# EasyEDA Pro project RoboClawHat.eprj

# Schematic Schematic1
Create Date: 2022-11-27; Page Name: Power; Project Name: Raven; Schematic Name: Schematic1; Update Date: 2022-11-27; Company: Wimble Robotics; Drawed: Michael Wimble; Page Size: A4; Part Number: JLCPCB-002; Reviewed: Michael Wimble; Version: V1.0
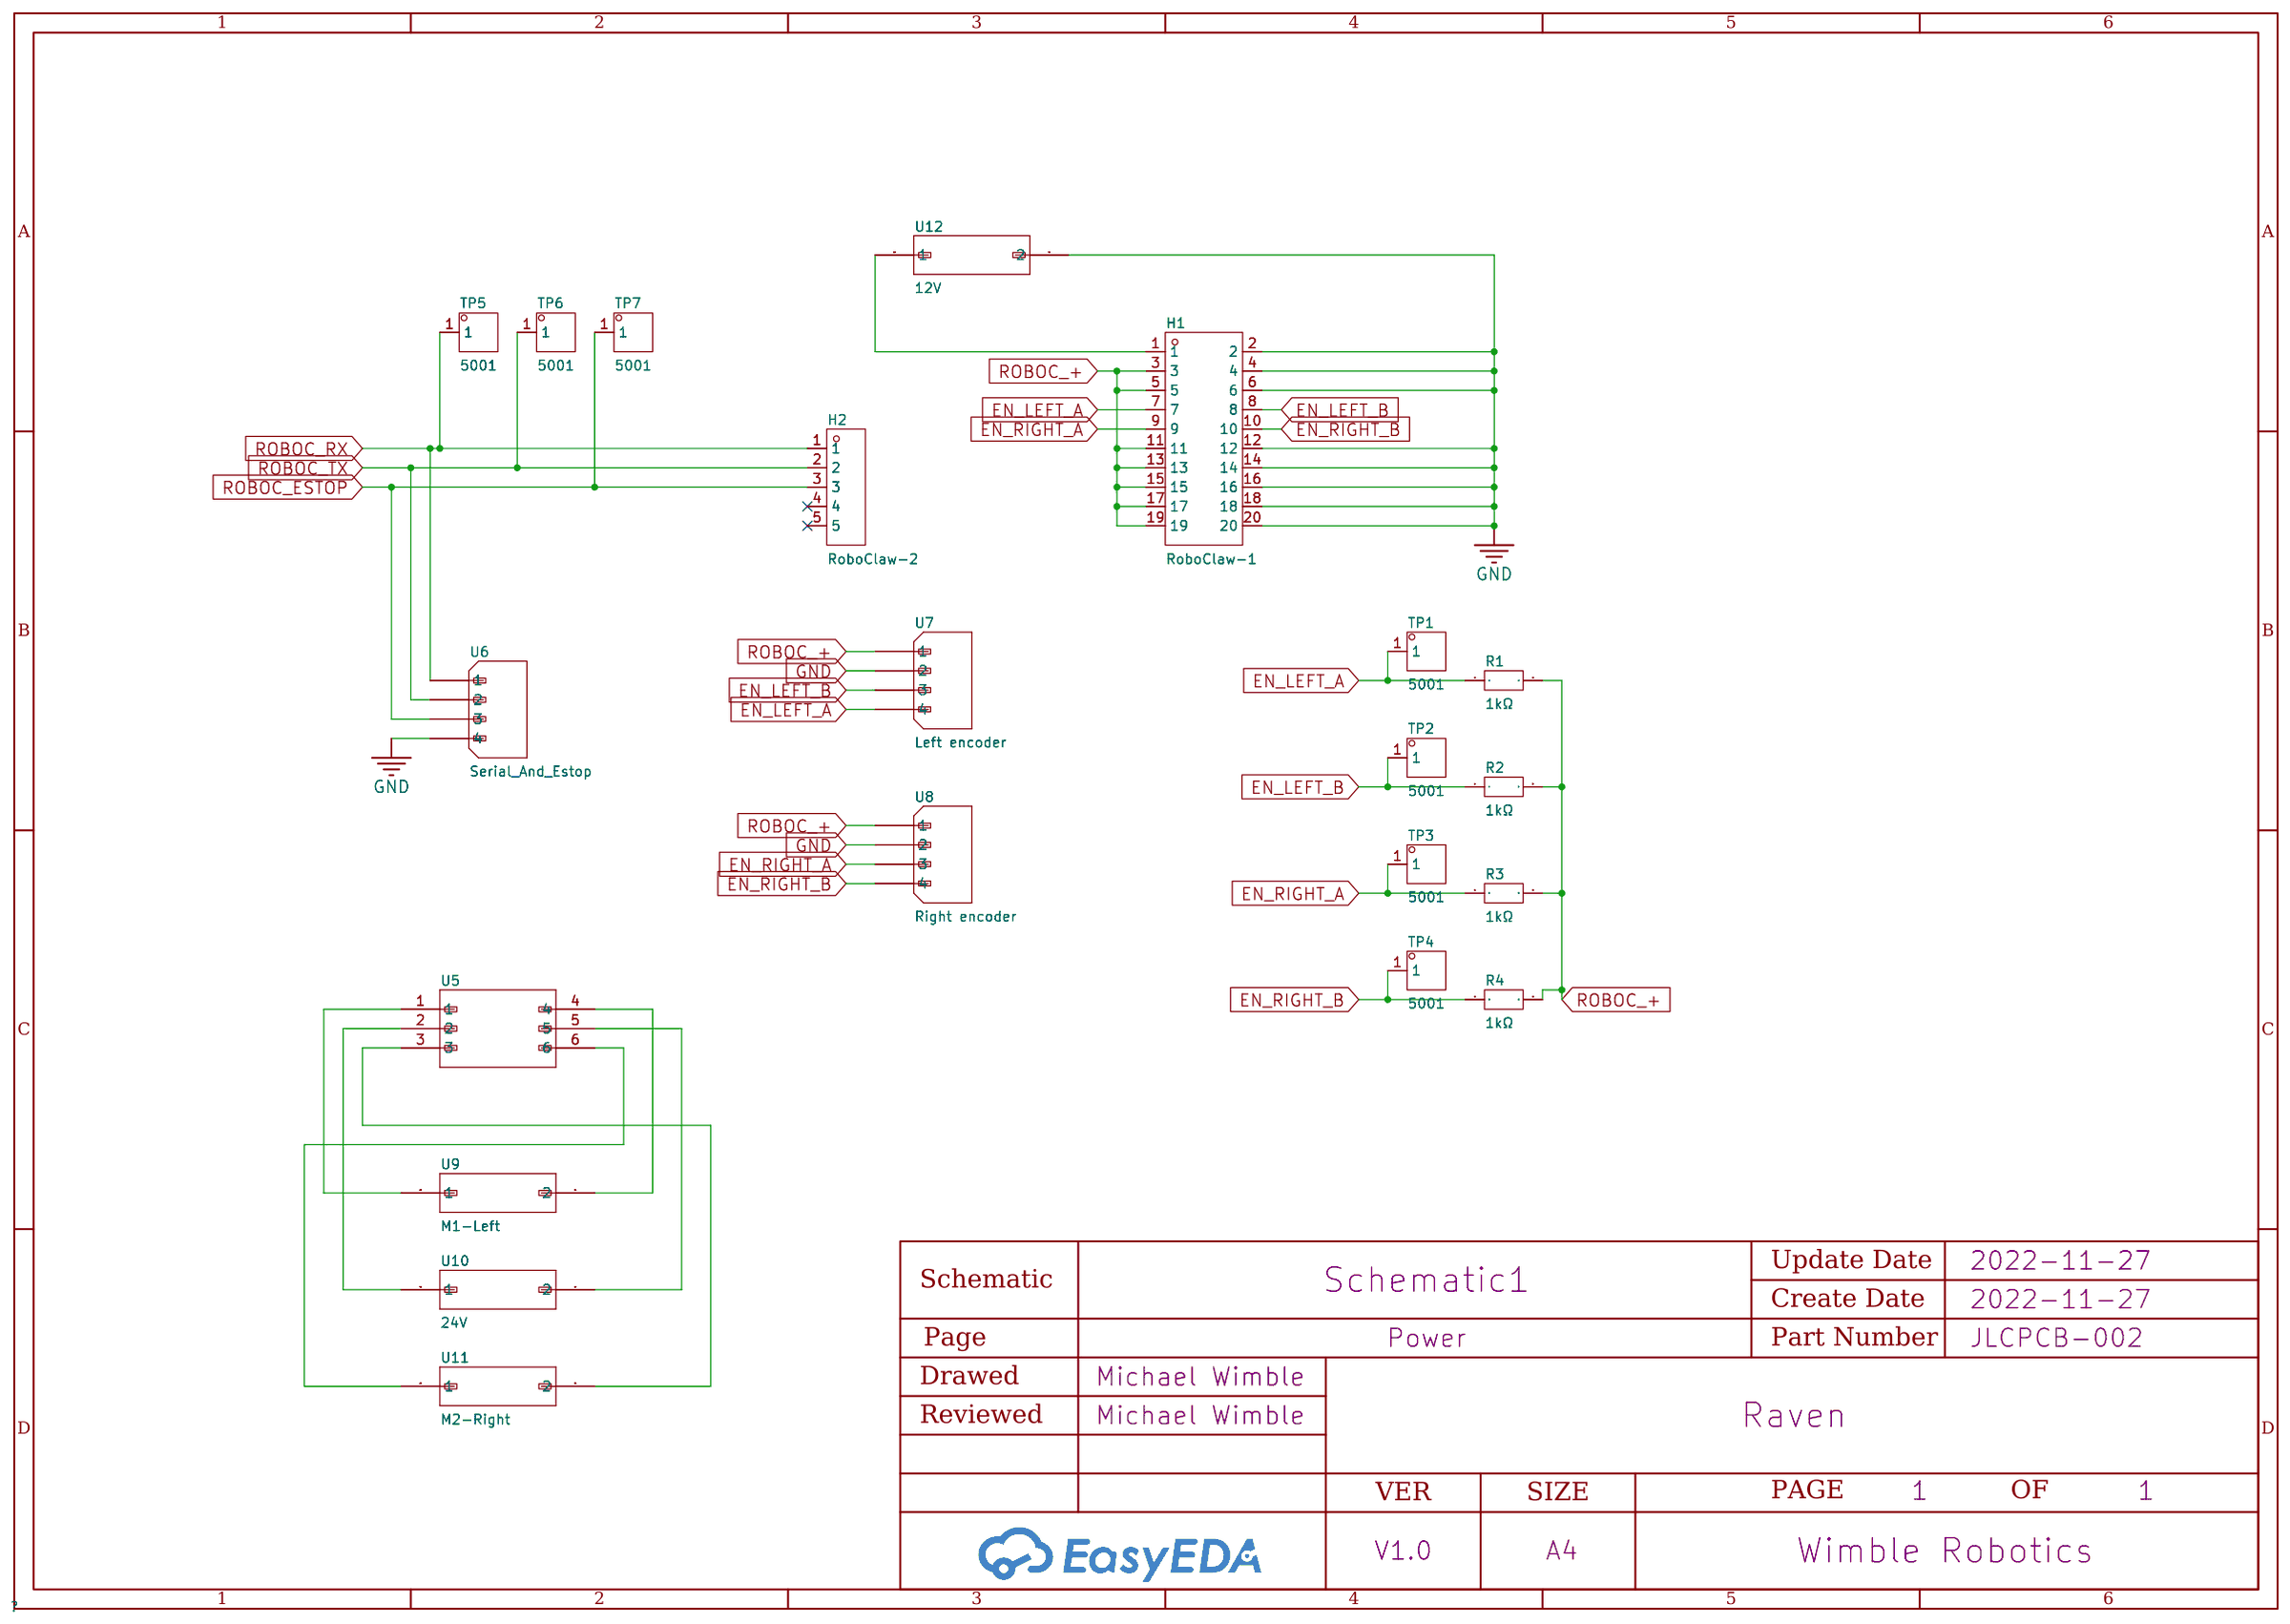
[diagram p0: schematic sheet]

## Parts
H1  RoboClaw-1  [HDR-TH_20P-P2.54-V-M-R2-C10-S2.54]
H2  RoboClaw-2  [HDR-TH_5P-P2.54-V-M]
R1  1kΩ  [R0603]
R2  1kΩ  [R0603]
R3  1kΩ  [R0603]
R4  1kΩ  [R0603]
TP1  5001  [TEST-TH_BD2.54-P1.39]
TP2  5001  [TEST-TH_BD2.54-P1.39]
TP3  5001  [TEST-TH_BD2.54-P1.39]
TP4  5001  [TEST-TH_BD2.54-P1.39]
TP5  5001  [TEST-TH_BD2.54-P1.39]
TP6  5001  [TEST-TH_BD2.54-P1.39]
TP7  5001  [TEST-TH_BD2.54-P1.39]
U5  -  [MOLEX_2068320601]
U6  Serial_And_Estop  [MOLEX_533750410]
U7  Left encoder  [MOLEX_533750410]
U8  Right encoder  [MOLEX_533750410]
U9  M1-Left  [MOLEX_2068320201]
U10  24V  [MOLEX_2068320201]
U11  M2-Right  [MOLEX_2068320201]
U12  12V  [MOLEX_2068320201]

## Library data of the parts
H1 = PZ254V-12-20P: Pitch:2.54mm Number of Pins:20 Number of Rows:2 Pin Structure:2x10P Row Spacing:2.54mm Mounting Type:直插 Circluar Pins/Square Pins:方针 Current Rating (Max):- Voltage Rating (Max):- Length of Mating Pin:6mm Insulation Height:2.5mm Length of End Connection Pi; LCSC Part Name: 2.54mm 2x10P 直插 方针; Supplier Part: C492427; Manufacturer: XFCN(兴飞); Supplier Footprint: 直插,P=2.54mm; JLCPCB Part Class: Extended Part; Datasheet: https://atta.szlcsc.com/upload/public/pdf/source/20200309/C492427_9411E93D35F2EC20CED9A3ED9F4BBE60.pdf; Supplier: LCSC; Pitch: 2.54mm; Number of Pins: 20; Number of Rows: 2; Pin Structure: 2x10P; Row Spacing: 2.54mm; Mounting Type: 直插; Circluar Pins/Square Pins: 方针; Length of Mating Pin: 6mm; Insulation Height: 2.5mm; Length of End Connection Pin: 3mm; Contact Material: 黄铜; Operating Temperature Range: -40~+105; Color: 黑色
H2 = PZ254V-11-05P: Pitch:2.54mm Number of Pins:5 Number of Rows:1 Pin Structure:1x5P Row Spacing:- Mounting Type:直插 Circluar Pins/Square Pins:方针 Current Rating (Max):- Voltage Rating (Max):- Length of Mating Pin:6mm Insulation Height:2.5mm Length of End Connection Pin:3mm C; LCSC Part Name: 2.54mm 1x5P 直插 方针; Supplier Part: C492404; Manufacturer: XFCN(兴飞); Supplier Footprint: 直插,P=2.54mm; JLCPCB Part Class: Extended Part; Datasheet: https://atta.szlcsc.com/upload/public/pdf/source/20200309/C492404_E51533260F8710EFF5D4617281164C1D.pdf; Supplier: LCSC; Pitch: 2.54mm; Number of Pins: 5; Number of Rows: 1; Pin Structure: 1x5P; Mounting Type: 直插; Circluar Pins/Square Pins: 方针; Length of Mating Pin: 6mm; Insulation Height: 2.5mm; Length of End Connection Pin: 3mm; Contact Material: 黄铜; Operating Temperature Range: -40~+105; Color: 黑色
R1-R4 = FRC0603J102 TS: Type:Thick Film Resistors Resistance: Tolerance:±5% Tolerance:±5% Power(Watts): Temperature Coefficient: Temperature Coefficient: Overload Voltage (Max): Operating Temperature Range: Operating Temperature Range:; LCSC Part Name: 1kΩ ±5% 100mW; Supplier Part: C2907113; Manufacturer: FOJAN(富捷); Supplier Footprint: 0603; JLCPCB Part Class: Extended Part; Datasheet: https://atta.szlcsc.com/upload/public/pdf/source/20211102/08480A48F159CF742D398A1E4DC90941.pdf; Supplier: LCSC; Type: Thick Film Resistors; Tolerance: ±5%
TP1-TP7 = 5001_C238122: Supplier Part: C238122; Manufacturer: Keystone; JLCPCB Part Class: Extended Part; Datasheet: https://atta.szlcsc.com/upload/public/pdf/source/20180629/C238122_5414CA0820D317C81C4E2A76836F6CFC.PDF; Supplier: LCSC
U5 = Molex 6-pin locking 12.5A/pin 2068320601
U6-U8 = Molex 4-pin locking 533750410
U9-U12 = 2068320201: Supplier Part: https://www.digikey.com/en/products/detail/molex/2068320201/10209711

## Nets
GND: H1.2 H1.3 H1.4 H1.5 H1.6 H1.7 H1.8 H1.9 H1.10 H1.11 H1.12 H1.13 H1.14 H1.15 H1.16 H1.17 H1.18 H1.19 H1.20 H2.1 H2.2 H2.3 R1.1 R1.2 R2.1 R2.2 R3.1 R3.2 R4.1 R4.2 TP1.1 TP2.1 TP3.1 TP4.1 TP5.1 TP6.1 TP7.1 U6.(4) U7.(4) U8.(4) U12.BLACK(2)
Net-(H1-1): H1.1 U12.RED(1)
Net-(U5-1): U5.1 U9.RED(1)
Net-(U5-2): U5.2 U10.RED(1)
Net-(U5-3): U5.3 U11.BLACK(2)
Net-(U5-4): U5.4 U9.BLACK(2)
Net-(U5-5): U5.5 U10.BLACK(2)
Net-(U5-6): U5.6 U11.RED(1)

Not connected (* = marked no-connect by the designer): H2 4* 5*

# Board PCB1
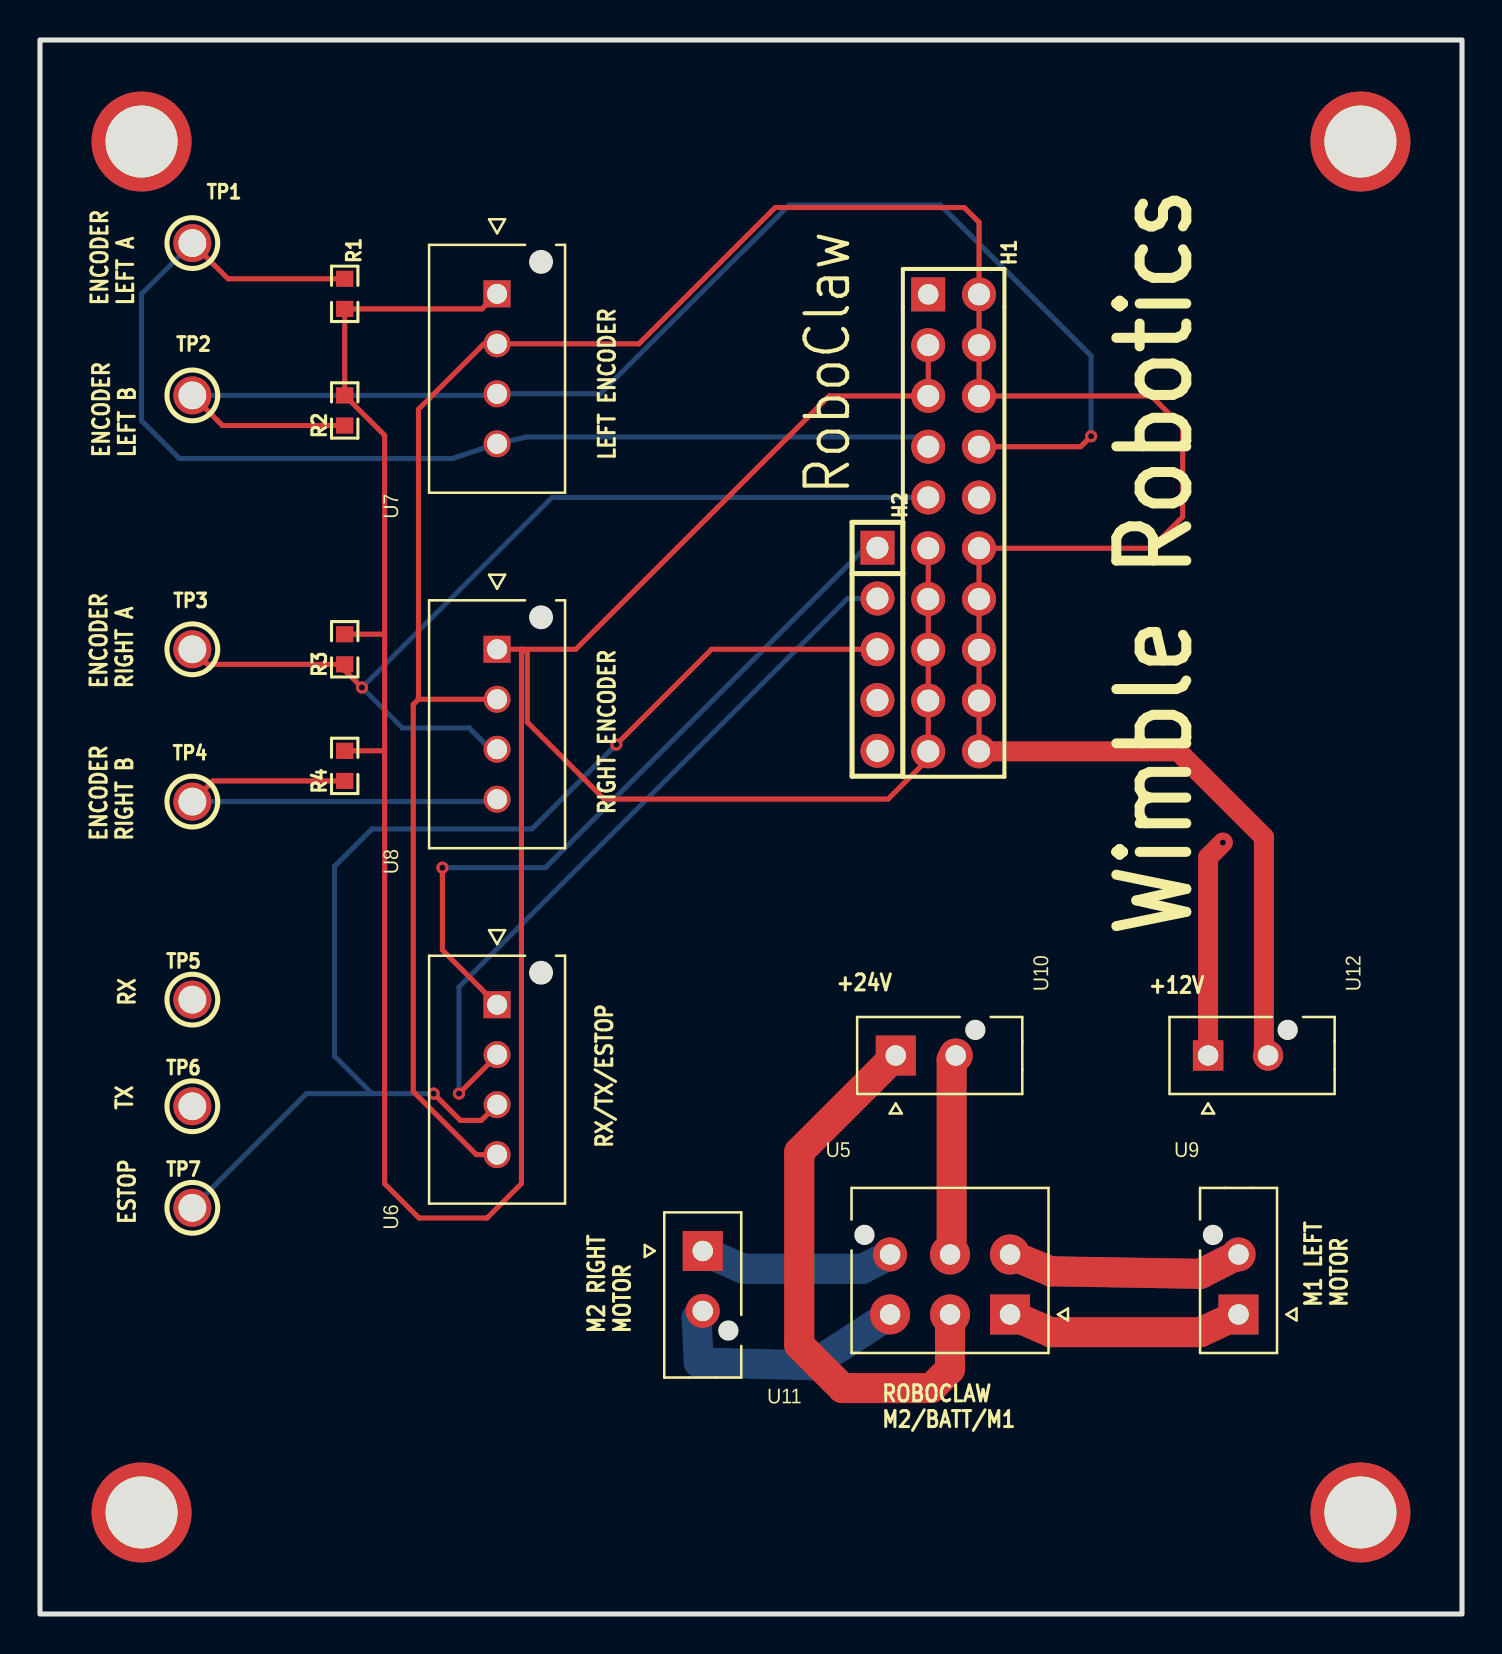
[diagram p1: board, top side]
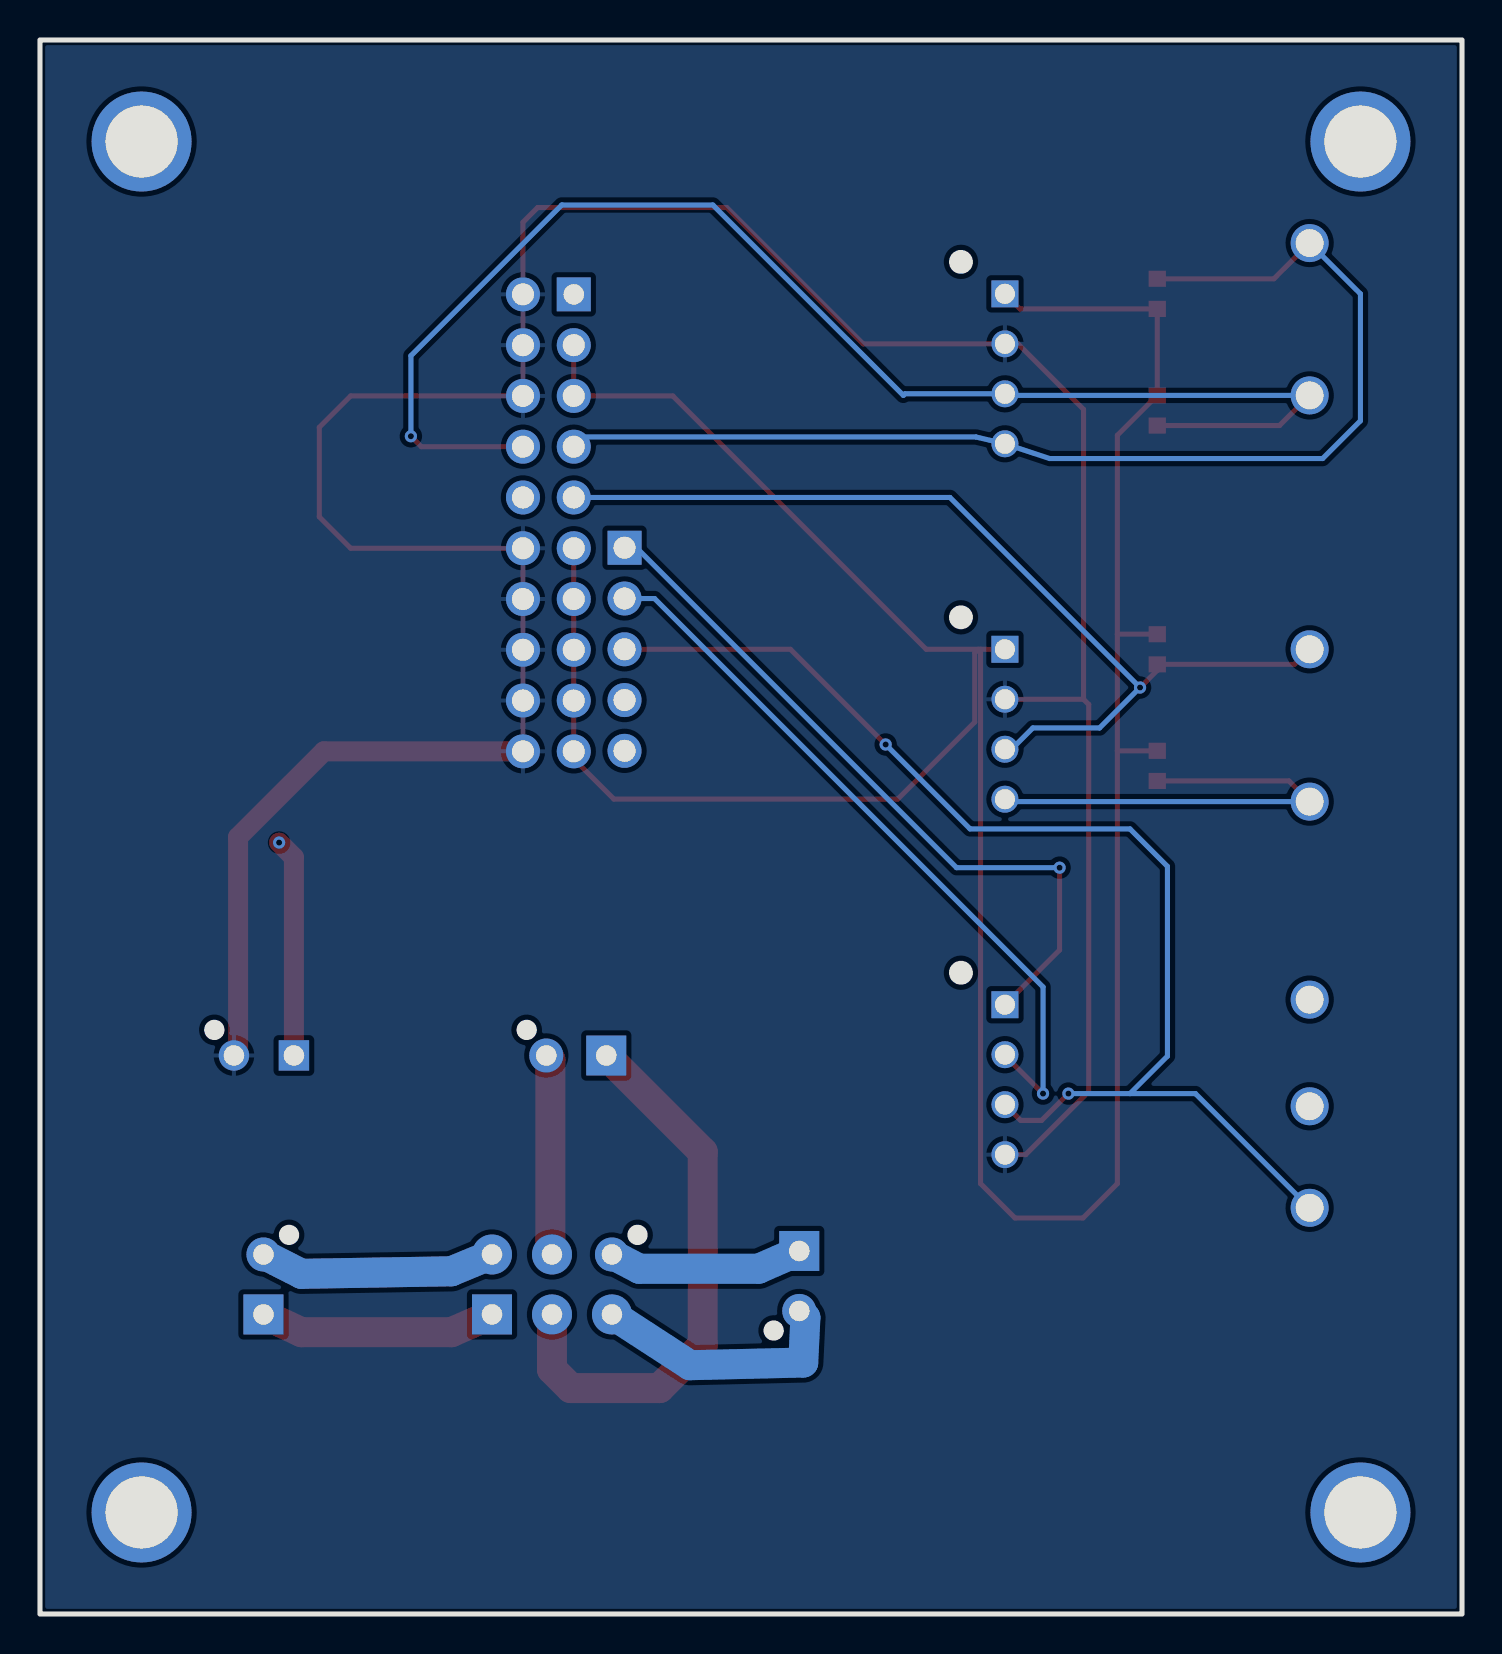
[diagram p2: board, bottom side, seen from below]

Outline 71.12 x 78.74 mm; copper layers: Top Layer, Inner1, Inner2, Bottom Layer. Coordinates in mm from the lower left corner of the outline.
Outline path: rectangle 0,78.74 71.12,0
Stack: Top Layer 0.035mm / Dielectric1 0.48mm PP er 4.5 / Inner1 0.035mm / Dielectric2 0.48mm FR4 er 4.5 / Inner2 0.035mm / Dielectric3 0.48mm PP er 4.5 / Bottom Layer 0.035mm

## Design rules (mm)
spacing safeClearance (default): track to track 0.152, other pairs 0.152 to 0.3
track width trackWidth (default): min 0.127, default 0.254, max 2.54
differential pair differentialPair (default): width min 0.127, default 0.254, max 2.54; gap min 0.152, default 0.152
via viaSize (default): diameter min 0.5, default 0.61, max 10; hole min 0.3, default 0.305, max 6

## Placement (name value [footprint] x y rotation side)
H1  RoboClaw-1  [HDR-TH_20P-P2.54-V-M-R2-C10-S2.54]  45.69 54.58 270 top
H2  RoboClaw-2  [HDR-TH_5P-P2.54-V-M]  41.89 48.26 270 top
NOREF  -  [Pad_e205]  66.04 5.08 270 top
NOREF#2  -  [Pad_e201]  66.04 73.66 270 top
NOREF#3  -  [Pad_e203]  5.08 73.66 270 top
NOREF#4  -  [Pad_e204]  5.08 5.08 270 top
R1  1kΩ  [R0603]  15.24 66.04 270 top
R2  1kΩ  [R0603]  15.24 60.21 90 top
R3  1kΩ  [R0603]  15.24 48.26 90 top
R4  1kΩ  [R0603]  15.24 42.43 90 top
TP1  5001  [TEST-TH_BD2.54-P1.39]  7.62 68.58 0 top
TP2  5001  [TEST-TH_BD2.54-P1.39]  7.62 60.96 0 top
TP3  5001  [TEST-TH_BD2.54-P1.39]  7.62 48.26 0 top
TP4  5001  [TEST-TH_BD2.54-P1.39]  7.62 40.64 0 top
TP5  5001  [TEST-TH_BD2.54-P1.39]  7.62 30.73 0 top
TP6  5001  [TEST-TH_BD2.54-P1.39]  7.62 25.4 0 top
TP7  5001  [TEST-TH_BD2.54-P1.39]  7.62 20.32 0 top
U5  -  [MOLEX_2068320601]  48.51 14.99 0 top
U6  Serial_And_Estop  [MOLEX_533750410]  22.86 30.48 90 top
U7  Left encoder  [MOLEX_533750410]  22.86 66.04 90 top
U8  Right encoder  [MOLEX_533750410]  22.86 48.26 90 top
U9  M1-Left  [MOLEX_2068320201]  59.94 14.99 0 top
U10  24V  [MOLEX_2068320201]  42.8 27.94 270 top
U11  M2-Right  [MOLEX_2068320201]  33.15 18.16 180 top
U12  12V  [MOLEX_2068320201#2]  58.42 27.94 270 top

## Footprints (pads in the part's own frame, mm; a bottom-side part is the same pattern mirrored in y, then rotated)
HDR-TH_5P-P2.54-V-M
  rect 1.7x1.7 hole 1.1: 1(-5.08,0)
  round 1.7 hole 1.1: 2(-2.54,0) 3(0,0) 4(2.54,0) 5(5.08,0)
HDR-TH_20P-P2.54-V-M-R2-C10-S2.54
  rect 1.7x1.7 hole 1.02: 1(-11.43,-1.27)
  round 1.7 hole 1.1: 2(-11.43,1.27) 3(-8.89,-1.27) 4(-8.89,1.27) 5(-6.35,-1.27) 6(-6.35,1.27) 7(-3.81,-1.27) 8(-3.81,1.27) 9(-1.27,-1.27) 10(-1.27,1.27) 11(1.27,-1.27) 12(1.27,1.27) 13(3.81,-1.27) 14(3.81,1.27) 15(6.35,-1.27) 16(6.35,1.27) 17(8.89,-1.27) 18(8.89,1.27) 19(11.43,-1.27) 20(11.43,1.27)
MOLEX_533750410
  rect 1.35x1.35 hole 1: 1(0,0)
  round 1.35 hole 1: 2(-2.5,0) 3(-5,0) 4(-7.5,0)
MOLEX_2068320201
  rect 2x2 hole 1.02: 1(0,0)
  round 1.7 hole 1.02: 2(0,3)
MOLEX_2068320201#2
  rect 1.52x1.52 hole 1.02: 1(0,0)
  round 1.52 hole 1.02: 2(0,3)
MOLEX_2068320601
  rect 2x2 hole 1.02: 1(0,0)
  round 2 hole 1.02: 2(-3,0) 3(-6,0) 4(0,3) 5(-3,3)
  round 1.7 hole 1.02: 6(-6,3)
Pad_e201
  round 5 hole 3.6: 1(0,0)
Pad_e203
  round 5 hole 3.6: 2(0,0)
Pad_e204
  round 5 hole 3.6: 3(0,0)
Pad_e205
  round 5 hole 3.6: 4(0,0)
R0603
  rect 0.806x0.864 smd: 1(-0.753,0) 2(0.753,0)
TEST-TH_BD2.54-P1.39
  round 1.9 hole 1.39: 1(0,0)

## Nets
GND: H1.2 H1.4 H1.6 H1.12 H1.14 H1.16 H1.18 H1.20 U6.4 U7.2 U8.2 U12.2
EN_LEFT_A: H1.7 R1.1 TP1.1 U7.4
EN_LEFT_B: H1.8 R2.1 TP2.1 U7.3
EN_RIGHT_A: H1.9 R3.1 TP3.1 U8.3
EN_RIGHT_B: H1.10 R4.1 TP4.1 U8.4
ROBOC_+: H1.3 H1.5 H1.11 H1.13 H1.15 H1.17 H1.19 R1.2 R2.2 R3.2 R4.2 U7.1 U8.1
ROBOC_ESTOP: H2.3 TP7.1 U6.3
ROBOC_RX: H2.1 TP5.1 U6.1
ROBOC_TX: H2.2 TP6.1 U6.2
$1N6142: U5.1 U9.1
$1N6187: U5.4 U9.2
$1N6236: U5.2 U10.1
$1N6281: U5.5 U10.2
$1N6347: U5.3 U11.2
$1N6415: U5.6 U11.1
$1N10805: H1.1 U12.1

Pads without a net: H2 4 5; NOREF 4; NOREF#2 1; NOREF#3 2; NOREF#4 3

## Via types
v1: diameter 0.61, hole 0.305, Top Layer to Bottom Layer, 7 vias

## Routing (per net, layer and track width the routed paths; a pad name or vN(x,y) marks a point on that pad's centre or on a via; arc(x,y) is an arc through that point)
GND: length 148.2
  Top Layer w0.254: H1.20 H1.18 H1.16 H1.14 H1.12 55.58,53.31 57.15,54.88 57.15,59.36 55.58,60.93 H1.6 H1.4 H1.2 46.96,69.62 46.23,70.36 36.77,70.36 29.95,63.54 U7.2 22.21,63.54 18.93,60.26 18.93,45.76 ; U6.4 21.82,22.98 18.67,26.13 18.67,45.5 18.93,45.76 ; 18.93,45.76 U8.2
  Top Layer w1: H1.20 56.92,43.15 61.21,38.86 61.21,28.15 U12.2
EN_LEFT_A: length 58.8
  Top Layer w0.254: TP1.1 9.41,66.79 R1.1
  Bottom Layer w0.254: H1.7 43.94,58.88 24.31,58.88 U7.4 20.62,57.8 6.97,57.8 5.08,59.69 5.08,66.04 TP1.1
EN_LEFT_B: length 70.2
  Top Layer w0.254: v1(52.57,58.92) 52.05,58.39 H1.8 ; TP2.1 9.13,59.45 15.24,59.45
  Bottom Layer w0.254: v1(52.57,58.92) 52.57,62.94 45.03,70.48 37.46,70.48 27.94,60.96 27.86,61.04 U7.3 22.78,60.96 TP2.1
EN_RIGHT_A: length 49.7
  Top Layer w0.254: TP3.1 8.37,47.51 R3.1 15.24,47.21 v1(16.1,46.35)
  Bottom Layer w0.254: U8.3 22.53,43.26 21.47,44.32 18.13,44.32 v1(16.1,46.35) 25.61,55.85 H1.9
EN_RIGHT_B: length 75.3
  Top Layer w0.254: TP4.1 8.65,41.67 15.24,41.67
  Inner1 w0.254: H1.10 52.73,50.08 52.73,45.11 43.31,35.69 22.86,35.69 U8.4
  Bottom Layer w0.254: TP4.1 22.74,40.64 U8.4
ROBOC_+: length 157.6
  Top Layer w0.254: 24.18,48.26 24.08,48.26 ; 24.18,48.26 26.8,48.26 39.47,60.93 H1.5 H1.3 ; 24.18,48.26 24.37,48.07 24.37,44.61 28.22,40.77 42.42,40.77 44.42,42.77 H1.19 H1.17 H1.15 H1.13 H1.11 ; 24.08,48.26 24.08,21.53 22.36,19.81 18.96,19.81 17.24,21.53 17.24,43.18 ; 24.08,48.26 U8.1 ; 17.24,49.01 17.24,58.96 R2.2 R1.2 22.11,65.29 U7.1 ; 17.24,49.01 R3.2 ; 17.24,49.01 17.24,43.18 ; 17.24,43.18 R4.2
ROBOC_ESTOP: length 62.3
  Top Layer w0.254: U6.3 22.07,24.69 21.03,24.69 v1(19.69,26.03) ; H2.3 33.59,48.26 v1(28.83,43.5)
  Bottom Layer w0.254: 16.61,26.03 13.33,26.03 TP7.1 ; 16.61,26.03 v1(19.69,26.03) ; 16.61,26.03 14.73,27.91 14.73,37.4 16.61,39.27 24.6,39.27 v1(28.83,43.5)
ROBOC_RX: length 51.6
  Top Layer w0.254: v1(20.13,37.33) 20.13,33.21 U6.1
  Inner1 w0.254: TP5.1 14.22,37.33 v1(20.13,37.33)
  Bottom Layer w0.254: v1(20.13,37.33) 25.28,37.33 41.28,53.34 H2.1
ROBOC_TX: length 51.2
  Top Layer w0.254: U6.2 22.86,27.94 v1(20.95,26.03)
  Inner1 w0.254: TP6.1 8.25,24.76 19.68,24.76 v1(20.95,26.03)
  Bottom Layer w0.254: H2.2 40.39,50.8 20.95,31.37 v1(20.95,26.03)
$1N6142: length 23.6
  Top Layer w1.5: U5.1 50.55,14.1 58.04,14.1 U9.1
  Inner1 w1.5: U5.1 50.55,14.1 58.04,14.1 U9.1
$1N6187: length 35.5
  Top Layer w1.5: U5.4 50.55,17.14 58.04,17.02 U9.2
  Inner1 w1.5: U9.2 58.04,17.02 50.55,17.14 U5.4
  Bottom Layer w1.5: U5.4 50.55,17.14 58.04,17.02 U9.2
$1N6236: length 56.1
  Top Layer w1.5: U5.2 45.51,12.24 44.58,11.3 40.13,11.3 37.97,13.46 37.97,23.11 U10.1
  Inner1 w1.5: U5.2 45.51,12.24 44.58,11.3 40.13,11.3 37.97,13.46 37.97,23.11 U10.1
$1N6281: length 30.2
  Top Layer w1.5: U5.5 45.59,18.06 45.59,27.73 U10.2
  Inner1 w1.5: U10.2 45.59,27.73 45.59,18.06 U5.5
  Inner2 w1.5: U5.5 45.59,18.06 45.59,27.73 U10.2
$1N6347: length 26
  Inner2 w1.5: U11.2 32.84,14.82 32.95,12.58 38.61,12.45 U5.3
  Bottom Layer w1.5: U11.2 32.84,14.82 32.95,12.58 38.61,12.45 U5.3
$1N6415: length 19.5
  Inner2 w1.5: U11.1 35.18,17.27 41.15,17.27 U5.6
  Bottom Layer w1.5: U5.6 41.15,17.27 35.18,17.27 U11.1
$1N10805: length 50.2
  Top Layer w1: v1(59.16,38.59) 58.42,37.85 U12.1
  Inner1 w1: H1.1 44.42,67.16 45.59,68.33 47.5,68.33 50.04,65.79 50.04,58.42 59.16,49.3 v1(59.16,38.59)

## Copper pours and planes (outline as drawn; the poured copper is in the pictures)
GND on Bottom Layer: 0,78.74 71.12,78.74 71.12,0 0,0

## Text on the board
Top Silkscreen Layer: +24V | ROBOCLAW / M2/BATT/M1 | +12V | ENCODER / RIGHT A | ENCODER / RIGHT B | TX | ENCODER / LEFT A | ENCODER / LEFT B | RX | ESTOP | RX/TX/ESTOP | RIGHT ENCODER | LEFT ENCODER | M2 RIGHT / MOTOR | M1 LEFT / MOTOR | RoboClaw | Wimble Robotics
